# Altium project PCB_Project.PrjPcb
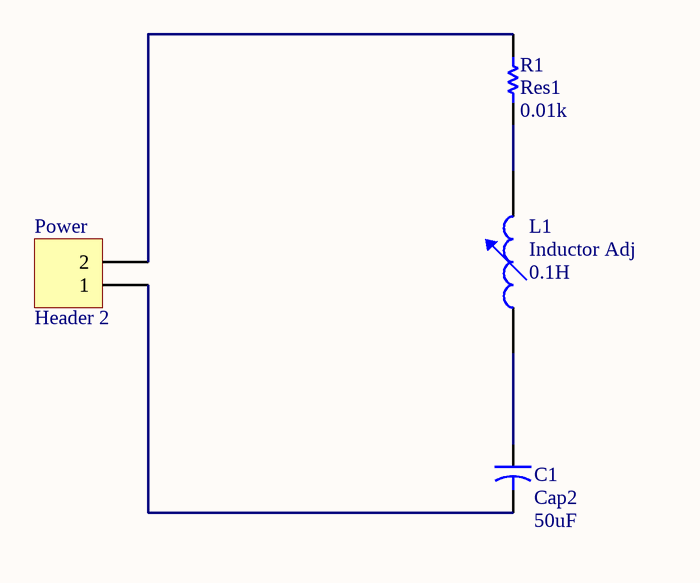
[diagram p0: series RLC.SchDoc]
1 sheet, 4 parts. Net scope: global (net labels, ports and power ports of the same name join across sheets).
Board files: AT long bus (13.3 x 4.2 inches).PCBDOC, PCB1(RLC).PcbDoc

## Sheet series RLC.SchDoc
size A4

### Parts
C1  Cap2  value 50uF  [CAPR5-4X5]
L1  Inductor Adj  value 0.1H  [AXIAL-0.8]
Power  Header 2  [HDR1X2]
R1  Res1  value 0.01k  [AXIAL-0.3]

### Nets
NetC1_1: C1.1 L1.1
NetC1_2: C1.2 Power.1
NetL1_2: L1.2 R1.1
NetPower_2: Power.2 R1.2

### Library data of the parts
C1 = Cap2: Capacitor; Published: 23-Sep-2002; PackageReference: CAPR5-4X5; Publisher: Altium Limited; PackageDescription: Capacitor; 2 Leads
L1 = Inductor Adj: Adjustable Inductor; Set Position: 0.5; Published: 24-Mar-1999; LatestRevisionDate: 17-Jul-2002; LatestRevisionNote: Re-released for DXP Platform.; PackageReference: AXIAL-0.8; Publisher: Altium Limited; PackageDescription: Axial Device, Thru-Hole; 2 Leads; 0.8 in Pin Spacing
Power = Header 2: Header, 2-Pin; LatestRevisionDate: 17-Jul-2002; LatestRevisionNote: Re-released for DXP Platform.; Publisher: Altium Limited
R1 = Res1: Resistor; Published: 8-Jun-2000; LatestRevisionDate: 17-Jul-2002; LatestRevisionNote: Re-released for DXP Platform.; PackageReference: AXIAL-0.3; Publisher: Altium Limited; PackageDescription: Axial Device, Thru-Hole; 2 Leads; 0.3 in Pin Spacing